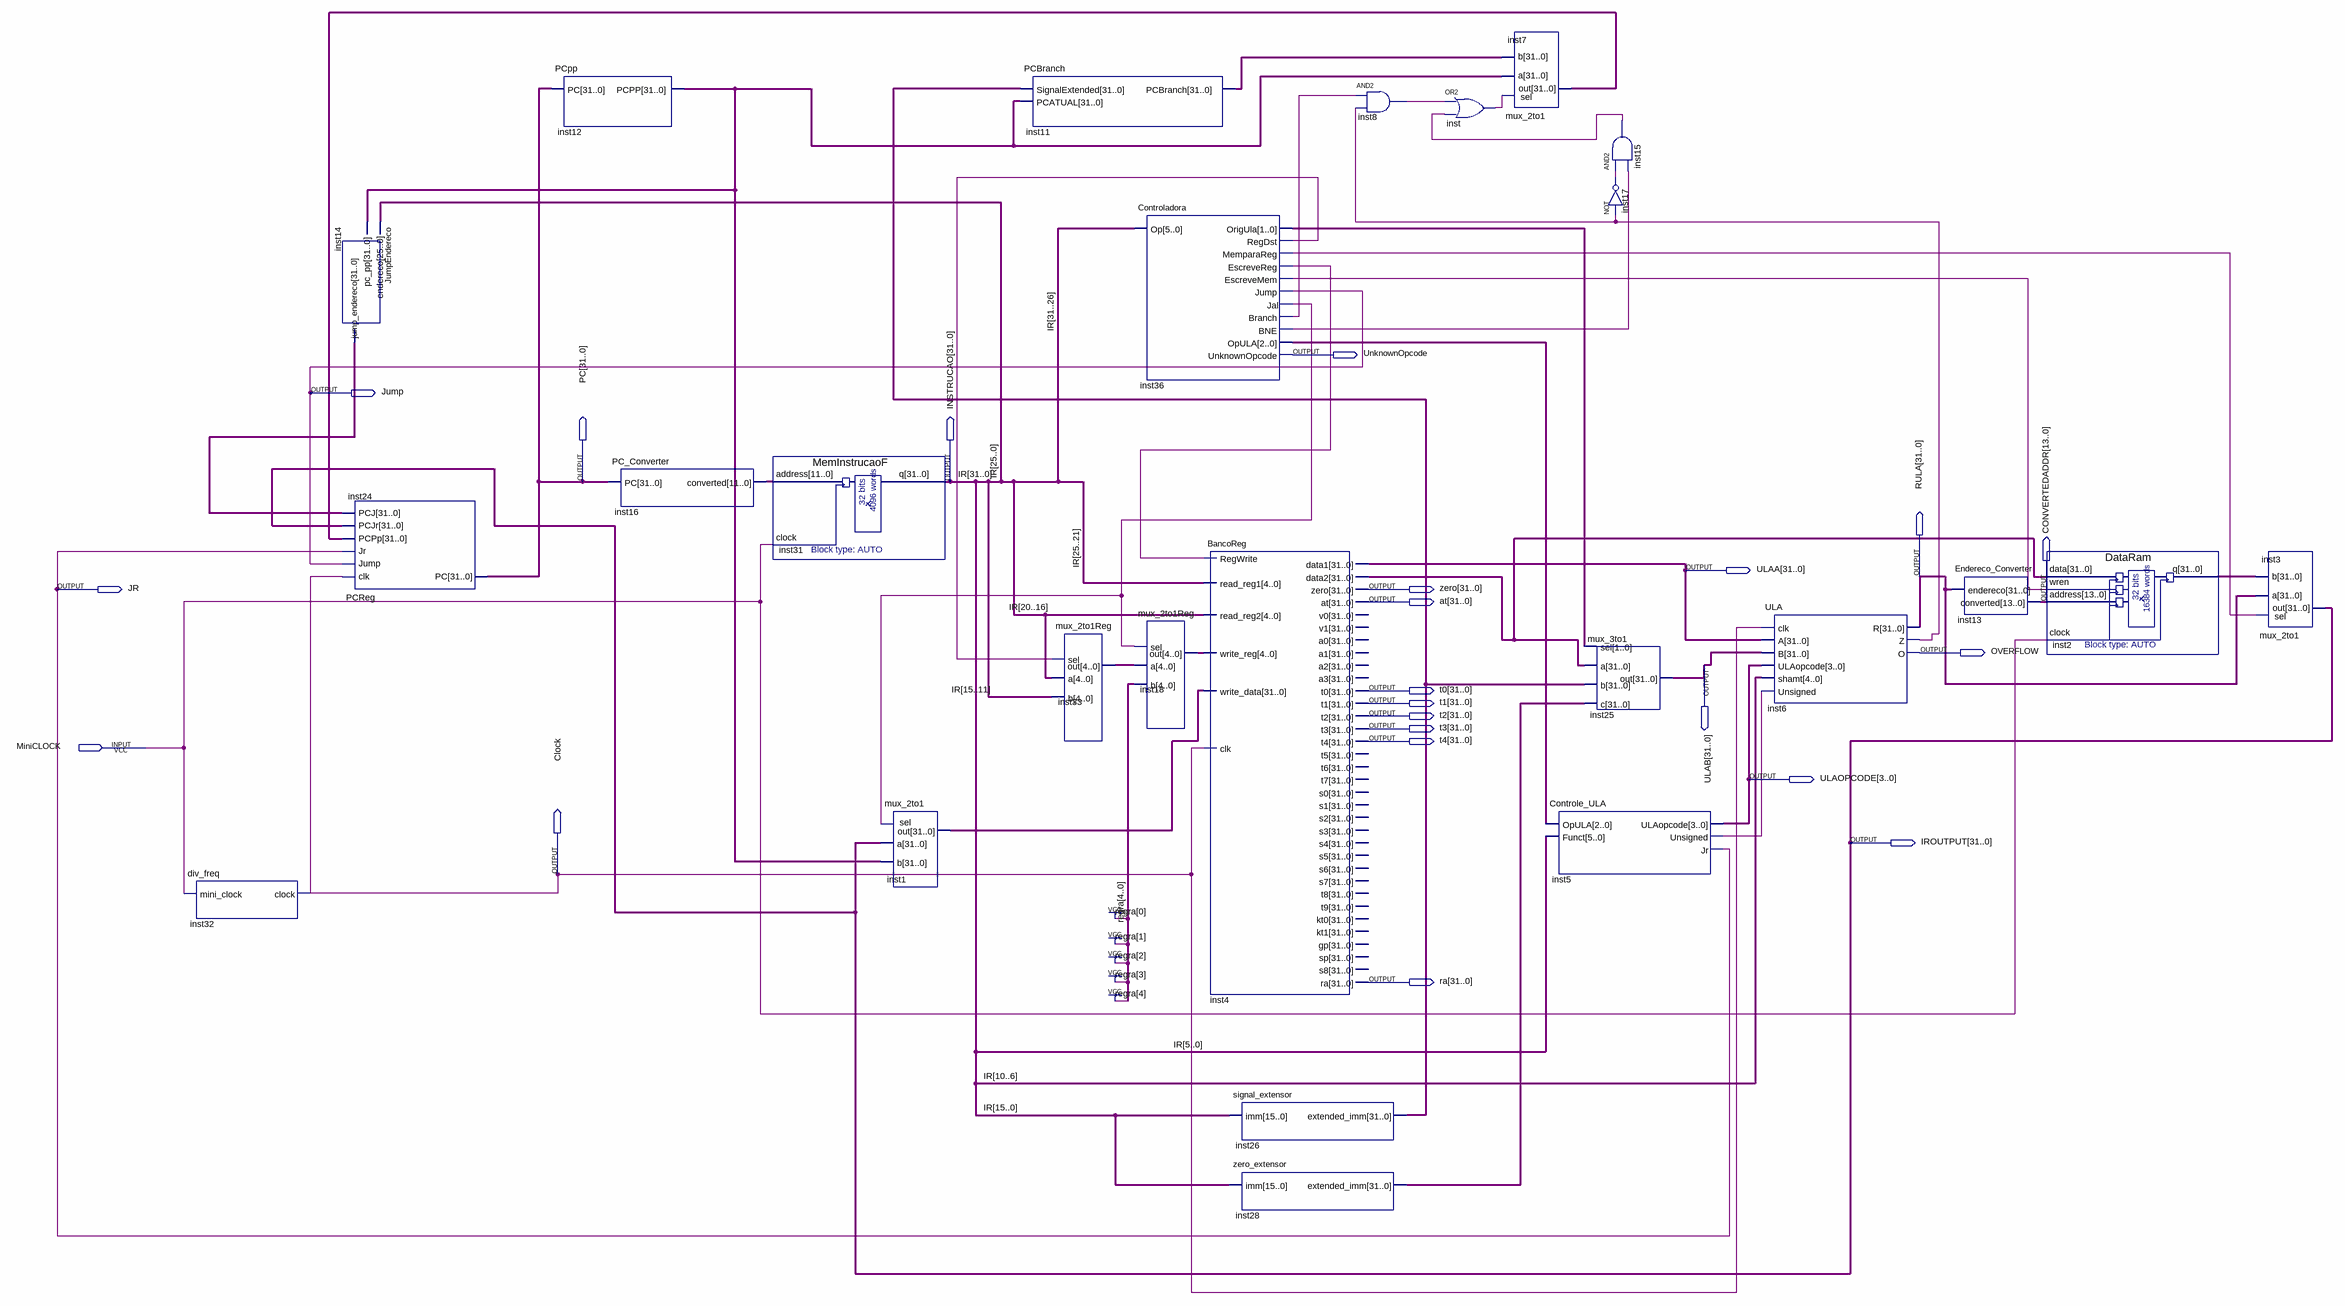
[diagram p0: schematic sheet]
// Quartus schematic main.bdf as structural Verilog: 25 symbols, 22 pins
module main (
  input  MiniCLOCK,
  output UnknownOpcode,
  output Jump,
  output [31:0] PC,
  output [31:0] INSTRUCAO,
  output [31:0] ULAA,
  output [31:0] RULA,
  output JR,
  output [31:0] zero,
  output [31:0] at,
  output [13:0] CONVERTEDADDR,
  output OVERFLOW,
  output [31:0] ULAB,
  output [31:0] t0,
  output [31:0] t1,
  output [31:0] t2,
  output [31:0] t3,
  output [31:0] t4,
  output [3:0] ULAOPCODE,
  output [31:0] IROUTPUT,
  output Clock,
  output [31:0] ra
);

  wire inst5_unsigned, inst6_z, inst8_out, inst15_out, inst17_out, inst36_bne, inst36_branch,
       inst36_escrevemem, inst36_escrevereg, inst36_jal, inst36_memparareg, inst36_regdst, inst_out;
  wire [1:0] inst36_origula;
  wire [2:0] inst36_opula;
  wire [4:0] inst18_out, inst33_out;
  wire [11:0] inst16_converted;
  wire [31:0] inst1_out, inst2_q, inst4_data2, inst7_out, inst11_pcbranch, inst12_pcpp, inst14_jump_endereco,
       inst26_extended_imm, inst28_extended_imm;

  div_freq inst32 (.mini_clock(MiniCLOCK), .clock(Clock));
  JumpEndereco inst14 (.endereco(INSTRUCAO[25:0]), .pc_pp(inst12_pcpp), .jump_endereco(inst14_jump_endereco));
  PCReg inst24 (
    .clk(Clock), .Jump(Jump), .Jr(JR), .PCPp(inst7_out), .PCJr(IROUTPUT), .PCJ(inst14_jump_endereco), .PC(PC));
  PCpp inst12 (.PC(PC), .PCPP(inst12_pcpp));
  PC_Converter inst16 (.PC(PC), .converted(inst16_converted));
  MemInstrucaoF inst31 (.address(inst16_converted), .clock(MiniCLOCK), .q(INSTRUCAO));
  mux_2to1 inst1 (.a(IROUTPUT), .b(inst12_pcpp), .sel(inst36_jal), .out(inst1_out));
  PCBranch inst11 (.SignalExtended(inst26_extended_imm), .PCATUAL(inst12_pcpp), .PCBranch(inst11_pcbranch));
  mux_2to1Reg inst33 (.a(INSTRUCAO[20:16]), .b(INSTRUCAO[15:11]), .sel(inst36_regdst), .out(inst33_out));
  Controladora inst36 (
    .Op(INSTRUCAO[31:26]), .OrigUla(inst36_origula), .RegDst(inst36_regdst), .MemparaReg(inst36_memparareg),
    .EscreveReg(inst36_escrevereg), .EscreveMem(inst36_escrevemem), .Jump(Jump), .Jal(inst36_jal),
    .Branch(inst36_branch), .BNE(inst36_bne), .OpULA(inst36_opula), .UnknownOpcode(UnknownOpcode));
  mux_2to1Reg inst18 (.a(inst33_out), .b({5{1'b1}}), .sel(inst36_jal), .out(inst18_out));
  BancoReg inst4 (
    .clk(Clock), .RegWrite(inst36_escrevereg), .read_reg1(INSTRUCAO[25:21]), .read_reg2(INSTRUCAO[20:16]),
    .write_reg(inst18_out), .write_data(inst1_out), .data1(ULAA), .data2(inst4_data2), .zero(zero), .at(at),
    .t0(t0), .t1(t1), .t2(t2), .t3(t3), .t4(t4), .ra(ra));  // open: v0, v1, a0, a1, a2, a3, t5, t6, t7, s0, s1, s2, s3, s4, s5, s6, s7, t8, t9, kt0, kt1, gp, sp, s8
  signal_extensor inst26 (.imm(INSTRUCAO[15:0]), .extended_imm(inst26_extended_imm));
  zero_extensor inst28 (.imm(INSTRUCAO[15:0]), .extended_imm(inst28_extended_imm));
  and inst8 (inst8_out, inst36_branch, inst6_z);
  or inst (inst_out, inst8_out, inst15_out);
  mux_2to1 inst7 (.a(inst12_pcpp), .b(inst11_pcbranch), .sel(inst_out), .out(inst7_out));
  mux_3to1 inst25 (.a(inst4_data2), .b(inst26_extended_imm), .c(inst28_extended_imm), .sel(inst36_origula), .out(ULAB));
  Controle_ULA inst5 (
    .OpULA(inst36_opula), .Funct(INSTRUCAO[5:0]), .ULAopcode(ULAOPCODE), .Unsigned(inst5_unsigned), .Jr(JR));
  and inst15 (inst15_out, inst17_out, inst36_bne);
  not inst17 (inst17_out, inst6_z);
  ULA inst6 (
    .clk(Clock), .Unsigned(inst5_unsigned), .ULAopcode(ULAOPCODE), .A(ULAA), .B(ULAB),
    .shamt(INSTRUCAO[10:6]), .R(RULA), .Z(inst6_z), .O(OVERFLOW));
  Endereco_Converter inst13 (.endereco(RULA), .converted(CONVERTEDADDR));
  DataRam inst2 (.data(inst4_data2), .wren(inst36_escrevemem), .address(CONVERTEDADDR), .clock(MiniCLOCK), .q(inst2_q));
  mux_2to1 inst3 (.a(RULA), .b(inst2_q), .sel(inst36_memparareg), .out(IROUTPUT));

  // Other names for the same wires on the sheet: IR[31:0] = INSTRUCAO
endmodule
